# EAGLE design Emon (EAGLE 7.3.0)
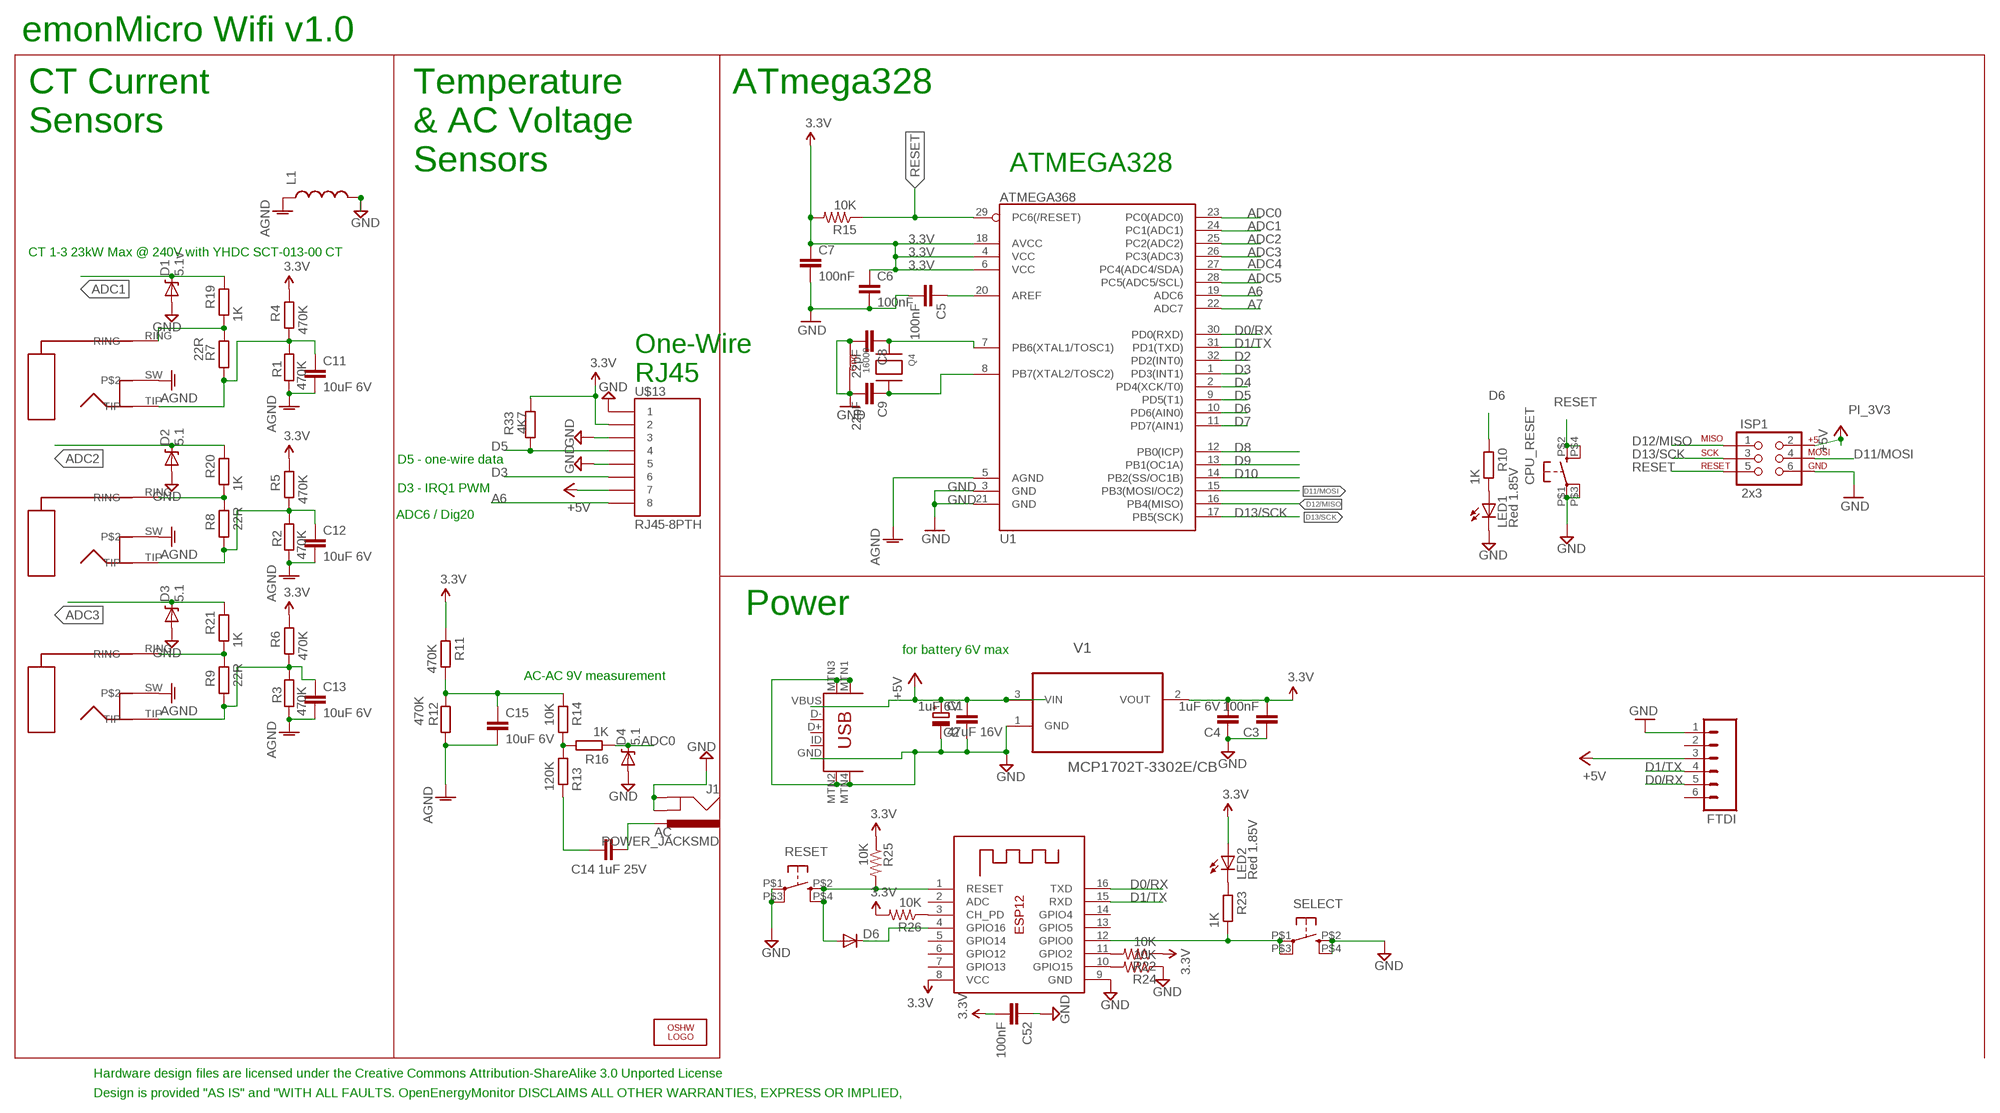
[diagram p0: schematic, sheet 1]

## Parts
C1  47uF 16V  CPOL-EUD  [PANASONIC_D]
C2  1uF 6V  C-EUC0603  [C0603]
C3  100nF  C-EUC0603  [C0603]
C4  1uF 6V  C-EUC0603  [C0603]
C5  100nF  C-EUC0603  [C0603]
C6  100nF  C-EUC0603  [C0603]
C7  100nF  C-EUC0603  [C0603]
C8  22pF  C-EUC0603  [C0603]
C9  22pF  C-EUC0603  [C0603]
C11  10uF 6V  C-EUC0603  [C0603]
C12  10uF 6V  C-EUC0603  [C0603]
C13  10uF 6V  C-EUC0603  [C0603]
C14  1uF 25V  C-EUC0603  [C0603]
C15  10uF 6V  C-EUC0603  [C0603]
C52  100nF  C-EUC0603  [C0603]
CPU_RESET  KMR211GLFS  BUTTON-KMR241GLFS  [PUSHBUTTON-KMR241GLFS]
D1  5.1v  DIODE-ZENER-BZT52  [SOD-323]
D2  5.1  DIODE-ZENER-BZT52  [SOD-323]
D3  5.1  DIODE-ZENER-BZT52  [SOD-323]
D4  5.1  DIODE-ZENER-BZT52  [SOD-323]
D6  DIODESOD  [SOD-323]
FTDI  M06LOCK  [1X06_LOCK]
ISP1  2x3  AVR_SPI_PRG_6PTH  [2X3]
J1  POWER_JACKSMD  [POWER_JACK_SMD]
L1  INDUCTOR0603  [0603]
LED1  Red 1.85V  LEDCHIP-LED0805  [CHIP-LED0805]
LED2  Red 1.85V  LEDCHIP-LED0805  [CHIP-LED0805]
LOGO1  OSHW_LOGO_6MILX0200-NT  [OSHW_6X200_NOTEXT]
Q4  16000  XTAL-4-3225  [NX3225]
R1  470K  R-EU_R0603  [R0603]
R2  470K  R-EU_R0603  [R0603]
R3  470K  R-EU_R0603  [R0603]
R4  470K  R-EU_R0603  [R0603]
R5  470K  R-EU_R0603  [R0603]
R6  470K  R-EU_R0603  [R0603]
R7  22R  R-EU_R1206  [R1206]
R8  22R  R-EU_R1206  [R1206]
R9  22R  R-EU_R1206  [R1206]
R10  1K  R-EU_R0603  [R0603]
R11  470K  R-EU_R0603  [R0603]
R12  470K  R-EU_R0603  [R0603]
R13  120K  R-EU_R0603  [R0603]
R14  10K  R-EU_R0603  [R0603]
R15  10K  R-US_R0603  [R0603]
R16  1K  R-EU_R0603  [R0603]
R19  1K  R-EU_R0603  [R0603]
R20  1K  R-EU_R0603  [R0603]
R21  1K  R-EU_R0603  [R0603]
R22  10K  R-US_R0603  [R0603]
R23  1K  R-EU_R0603  [R0603]
R24  10K  R-US_R0603  [R0603]
R25  10K  R-US_R0603  [R0603]
R26  10K  R-US_R0603  [R0603]
R33  4K7  R-EU_R0603  [R0603]
RESET  KMR211GLFS  BUTTON-KMR241GLFS  [PUSHBUTTON-KMR241GLFS]
SELECT  KMR211GLFS  BUTTON-KMR241GLFS  [PUSHBUTTON-KMR241GLFS]
U1  ATMEGA368  ATMEGA168  [TQFP32-08]
U$1  MJ-3523-SMT  [AUDIO_SMT]
U$2  MJ-3523-SMT  [AUDIO_SMT]
U$3  MJ-3523-SMT  [AUDIO_SMT]
U$13  RJ45-8PTH  [RJ45-8]
USB_POWER  USB-MINIB-5PIN  [USB-MINIB-CISECO]
V1  MCP1702T-3302E/CB  MCP1700T-3302E/TT  [SOT95P237X112-3N]
X1  ESP-12  [ESP-12]

## Nets
3.3V: C3.2 C4.2 C6.1 C7.1 C52.2 LED2.A R4.2 R5.2 R6.2 R11.2 R15.2 R22.1 R25.1 R26.2 R33.1 U1.4(VCC) U1.6(VCC) U1.18(AVCC) U$13.2 V1.2(VOUT) X1.8(VCC)
+5V [power]: C1.+ C2.2 FTDI.3 ISP1.2 U$13.7 USB_POWER.VBUS V1.3(VIN)
A6: U1.19(ADC6) U$13.8
A7: U1.22(ADC7)
AC: C14.2 J1.VIN0(PWR)
ADC0: D4.1(C) R16.1 U1.23(PC0(ADC0))
ADC1: D1.1(C) R19.2 U1.24(PC1(ADC1))
ADC2: D2.1(C) R20.2 U1.25(PC2(ADC2))
ADC3: D3.1(C) R21.2 U1.26(PC3(ADC3))
ADC4: U1.27(PC4(ADC4/SDA))
ADC5: U1.28(PC5(ADC5/SCL))
AGND [gnd]: C11.2 C12.2 C13.2 C15.2 L1.1 R1.2 R2.2 R3.2 R12.1 U1.5(AGND) U$1.SW U$2.SW U$3.SW
D0/RX: FTDI.5 U1.30(PD0(RXD)) X1.16(TXD)
D1/TX: FTDI.4 U1.31(PD1(TXD)) X1.15(RXD)
D2: U1.32(PD2(INT0))
D3: U1.1(PD3(INT1)) U$13.6
D4: U1.2(PD4(XCK/T0))
D5: R33.2 U1.9(PD5(T1)) U$13.4
D6: R10.2 U1.10(PD6(AIN0))
D7: U1.11(PD7(AIN1))
D8: U1.12(PB0(ICP))
D9: U1.13(PB1(OC1A))
D10: U1.14(PB2(SS/OC1B))
D11/MOSI: ISP1.4 U1.15(PB3(MOSI/OC2))
D12/MISO: ISP1.1 U1.16(PB4(MISO))
D13/SCK: ISP1.3 U1.17(PB5(SCK))
GND [gnd]: C1.- C2.1 C3.1 C4.1 C5.2 C6.2 C7.2 C8.2 C9.2 C52.1 CPU_RESET.P$1 CPU_RESET.P$3 D1.2(A) D2.2(A) D3.2(A) D4.2(A) FTDI.1 ISP1.6 J1.GND(GNDBREAK) J1.P$4(GND) L1.2 LED1.C Q4.1(G1) Q4.3(G2) R24.1 RESET.P$1 RESET.P$3 SELECT.P$2 SELECT.P$4 U1.3(GND) U1.21(GND) U$13.1 U$13.3 U$13.5 USB_POWER.GND USB_POWER.MTN1(MTN2) USB_POWER.MTN2(MTN3) USB_POWER.MTN3(MTN1) USB_POWER.MTN4 V1.1(GND) X1.9(GND)
GND1: R23.1 SELECT.P$1 SELECT.P$3 X1.12(GPIO0)
N$1: C8.1 Q4.2(X1) U1.7(PB6(XTAL1/TOSC1))
N$2: R7.2 R19.1 U$2.RING
N$3: C13.1 R3.1 R6.1 R9.1 U$3.TIP
N$4: R13.2 R14.1 R16.2
N$5: R24.2 X1.10(GPIO15)
N$6: R22.2 X1.11(GPIO2)
N$7: C14.1 R13.1
N$8: R26.1 X1.3(CH_PD)
N$10: R8.2 R20.1 U$1.RING
N$11: LED2.C R23.2
N$12: D6.1(C) X1.4(GPIO16)
N$13: R9.2 R21.1 U$3.RING
N$14: C9.1 Q4.4(X2) U1.8(PB7(XTAL2/TOSC2))
N$15: D6.2(A) R25.2 RESET.P$2 RESET.P$4 X1.1(RESET)
N$20: C5.1 U1.20(AREF)
N$33: C12.1 R2.1 R5.1 R8.1 U$1.TIP
N$34: C15.1 R11.1 R12.2 R14.2
N$38: C11.1 R1.1 R4.1 R7.1 U$2.TIP
N$41: LED1.A R10.1
RESET: CPU_RESET.P$2 CPU_RESET.P$4 ISP1.5 R15.1 U1.29(PC6(/RESET))
Unconnected: FTDI.2 FTDI.6 USB_POWER.D+ USB_POWER.D- USB_POWER.ID X1.2(ADC) X1.5(GPIO14) X1.6(GPIO12) X1.7(GPIO13) X1.13(GPIO5) X1.14(GPIO4)

## Notes on the sheet
- emonMicro Wifi v1.0
- ATmega328
- CT Current 
  Sensors
- Temperature 
  & AC Voltage
  Sensors
- ATMEGA328
- CT 1-3 23kW Max @ 240V with YHDC SCT-013-00 CT
- One-Wire
  RJ45
- D5 - one-wire data
- D3 - IRQ1 PWM
- ADC6 / Dig20
- Power
- for battery 6V max
- AC-AC 9V measurement
- Hardware design files are licensed under the Creative Commons Attribution-ShareAlike 3.0 Unported License
- Design is provided "AS IS" and "WITH ALL FAULTS. OpenEnergyMonitor DISCLAIMS ALL OTHER WARRANTIES, EXPRESS OR IMPLIED,

## Library data of the parts
C1 = resistor:CPOL-EU: POLARIZED CAPACITOR, European symbol
C2-C6 C8 C9 C11-C15 C52 = resistor:C-EU: CAPACITOR, European symbol
C7 = rcl:C-EU: CAPACITOR, European symbol
CPU_RESET RESET SELECT = okie:BUTTON-KMR241GLFS
D1-D4 = SparkFun:DIODE-ZENER: Zener Diode Production Part - 8199 3.4V Zener Voltage
D6 = SparkFun:DIODE: Diode These are standard reverse protection diodes and small signal diodes. SMA package can handle up to about 1A. SOD-323 can handle about 200mA. What the SOD-323 package when ordering, there are some mfgs out there that are 5-pin packages.
FTDI = SparkFun:M06: Header 6 Standard 6-pin 0.1" header. Use with straight break away headers (SKU : PRT-00116), right angle break away headers (PRT-00553), swiss pins (PRT-00743), machine pins (PRT-00117), and female headers (PRT-00115). Molex polarized connector foot print use with SKU : PRT-08094 with associated crimp pins and housings. NOTES ON THE VARIANTS LOCK and LOCK_LONGPADS... This footprint was designed to help hold the alignment of a through-hole component (i.e. 6-pin header) while soldering it into place. You may notice that each hole has been shifted either up or down by 0.005 of an inch from it's more standard position (which is a perfectly straight line). This slight alteration caused the pins (the squares in the middle) to touch the edges of the holes. Because they are alternating, it causes a "brace" to hold the component in place. 0.005 has proven to be the perfect amount of "off-center" position when using our standard breakaway headers. Although looks a little odd when you look at the bare footprint, once you have a header in there, the alteration is very hard to notice. Also, if you push a header all the way into place, it is covered up entirely on the bottom side. This idea of altering the position of holes to aid alignment will be further integrated into the Sparkfun Library for other footprints. It can help hold any component with 3 or more connection pins.
ISP1 = SparkFun:AVR_SPI_PRG_6: AVR ISP 6 Pin This is the reduced ISP connector for AVR programming. Common on Arduino. This footprint will take up less PCB space and can be used with a 10-pin to 6-pin adapter such as SKU: BOB-08508
J1 = SparkFun:POWER_JACK: Power Jack This is the standard 5.5mm barrel jack for power. The PTH is the most common, proven, reliable, footprint. All others are experimental. The Slot footprint only works if the mill layer is transmitted to the PCB fab house so be warned. Spark Fun Electronics SKU : PRT-00119. Mating wall wart : TOL-00298 (and others)
L1 = SparkFun:INDUCTOR: Inductors Basic Inductor/Choke - 0603 and 1206. Footprints are not proven and vary greatly between part numbers.
LED1 LED2 = adafruit:LED: LED OSRAM: - CHIPLED LG R971, LG N971, LY N971, LG Q971, LY Q971, LO R971, LY R971 LH N974, LH R974 LS Q976, LO Q976, LY Q976 LO Q996 - Hyper CHIPLED LW Q18S LB Q993, LB Q99A, LB R99A - SideLED LS A670, LO A670, LY A670, LG A670, LP A670 LB A673, LV A673, LT A673, LW A673 LH A674 LY A675 LS A676, LA A676, LO A676, LY A676, LW A676 LS A679, LY A679, LG A679 - Hyper Micro SIDELED� LS Y876, LA Y876, LO Y876, LY Y876 LT Y87S - SmartLED LW L88C, LW L88S LB L89C, LB L89S, LG L890 LS L89K, LO L89K, LY L89K LS L896, LA L896, LO L896, LY L896 - TOPLED LS T670, LO T670, LY T670, LG T670, LP T670 LSG T670, LSP T670, LSY T670, LOP T670, LYG T670 LG T671, LOG T671, LSG T671 LB T673, LV T673, LT T673, LW T673 LH T674 LS T676, LA T676, LO T676, LY T676, LB T676, LH T676, LSB T676, LW T676 LB T67C, LV T67C, LT T67C, LS T67K, LO T67K, LY T67K, LW E67C LS E67B, LA E67B, LO E67B, LY E67B, LB E67C, LV E67C, LT E67C LW T67C LS T679, LY T679, LG T679 LS T770, LO T770, LY T770, LG T770, LP T770 LB T773, LV T773, LT T773, LW T773 LH T774 LS E675, LA E675, LY E675, LS T675 LS T776, LA T776, LO T776, LY T776, LB T776 LHGB T686 LT T68C, LB T68C - Hyper Mini TOPLED� LB M676 - Mini TOPLED Santana� LG M470 LS M47K, LO M47K, LY M47K Source: http://www.osram.convergy.de/
LOGO1 = ohw-logo:OSHW_LOGO_6MIL
Q4 = adafruit:XTAL-4: Classic 4-pin 3.2 x 2.5mm crystal
R1-R14 R16 R19-R21 R23 R33 = rcl:R-EU_: RESISTOR, European symbol
R15 R22 R24-R26 = adafruit:R-US_: RESISTOR, American symbol
U1 = SparkFun:ATMEGA168
U$1-U$3 = Qxd:MJ-3523-SMT
U$13 = SparkFun-Connectors:RJ45-8: RJ45 Jack Simple RJ45, 8-pin connection - connector for common Cat5, Cat5e, and Cat6 Ethernet cables. Footprint not yet proven in production. Connector sku is PRT-00643; Breakout PCB sku is BOB-00716.
USB_POWER = Ciseco USB miniB:USB-MINIB: Mini-USB "B" connector with 5th pin broken out. Created new symbol breaking out 5th "ID" pin in mini/micro USB connector spec. See: http://en.wikipedia.org/wiki/Mini_usb#Cables. Uses same footprint as 4-pin symbol. Also added pins to connect to mounting / shield pads if required (probably not generally needed as signals aren't shielded once they leave the connector). Modified by Ciseco for Rapid Part 24-0357
V1 = Farnell_MCP1700:MCP1700T-3302E/TT: Low Quiescent Current LDO; MPN: MCP1700T-3302E/TT; OC_FARNELL: 1296592; OC_NEWARK: 88H9817; PACKAGE: SOT23-3; SUPPLIER: Microchip
X1 = adafruit:ESP-12

## Net classes
0 default: width 0.203 mm, drill 0.6 mm, clearance 0.203 mm
1 power: width 0.305 mm, drill 0.6 mm, clearance 0.254 mm
2 gnd: width 0.254 mm, drill 0.6 mm, clearance 0.254 mm

## Board
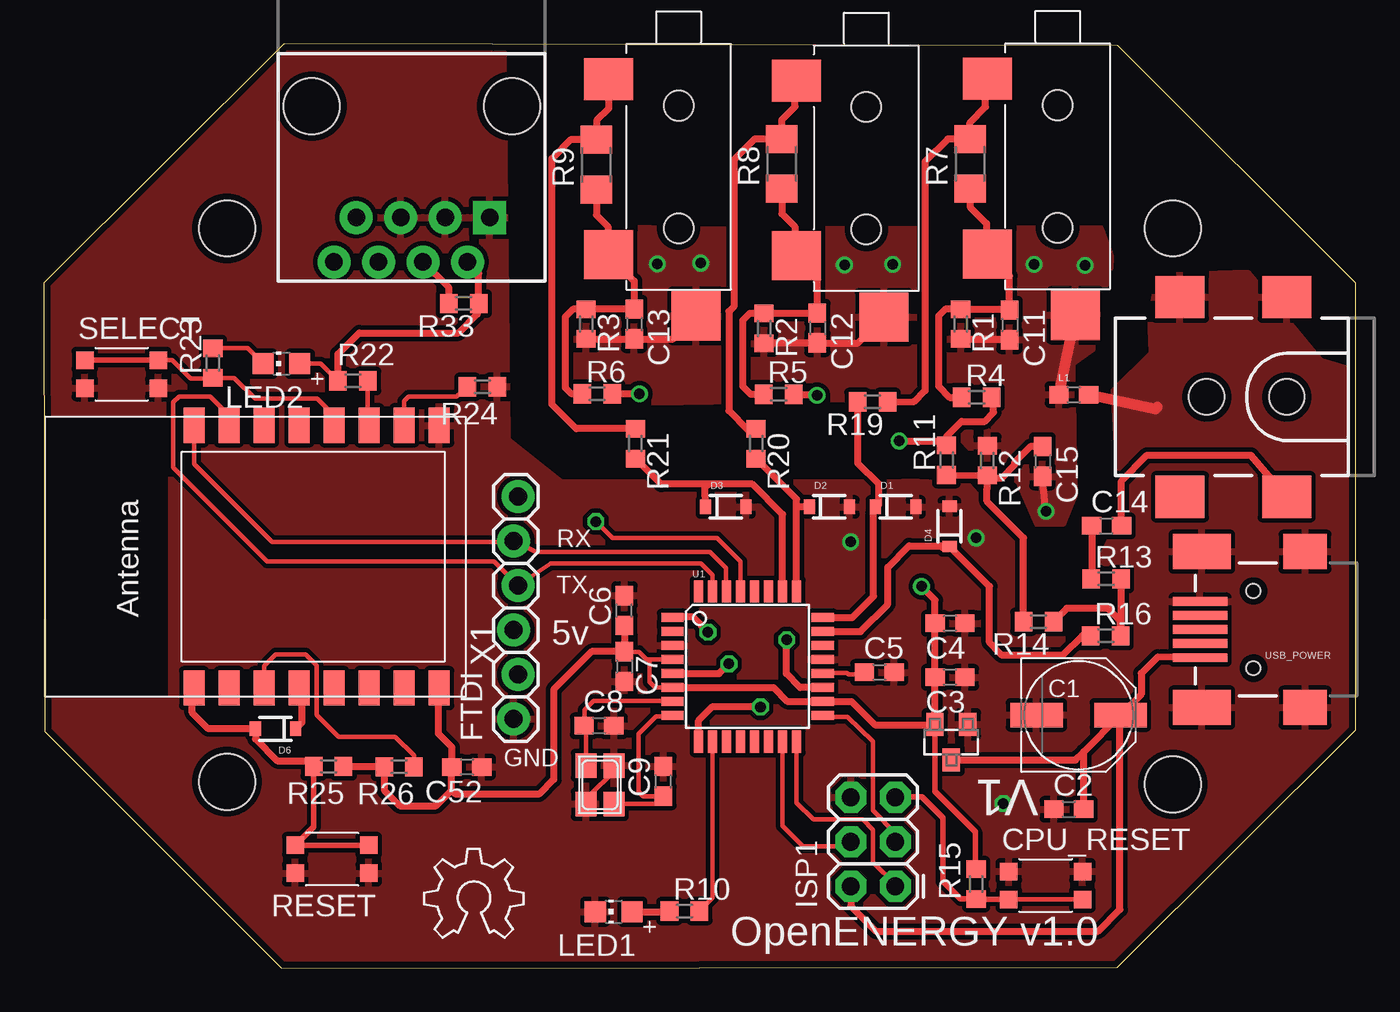
[diagram p1: board, top side]
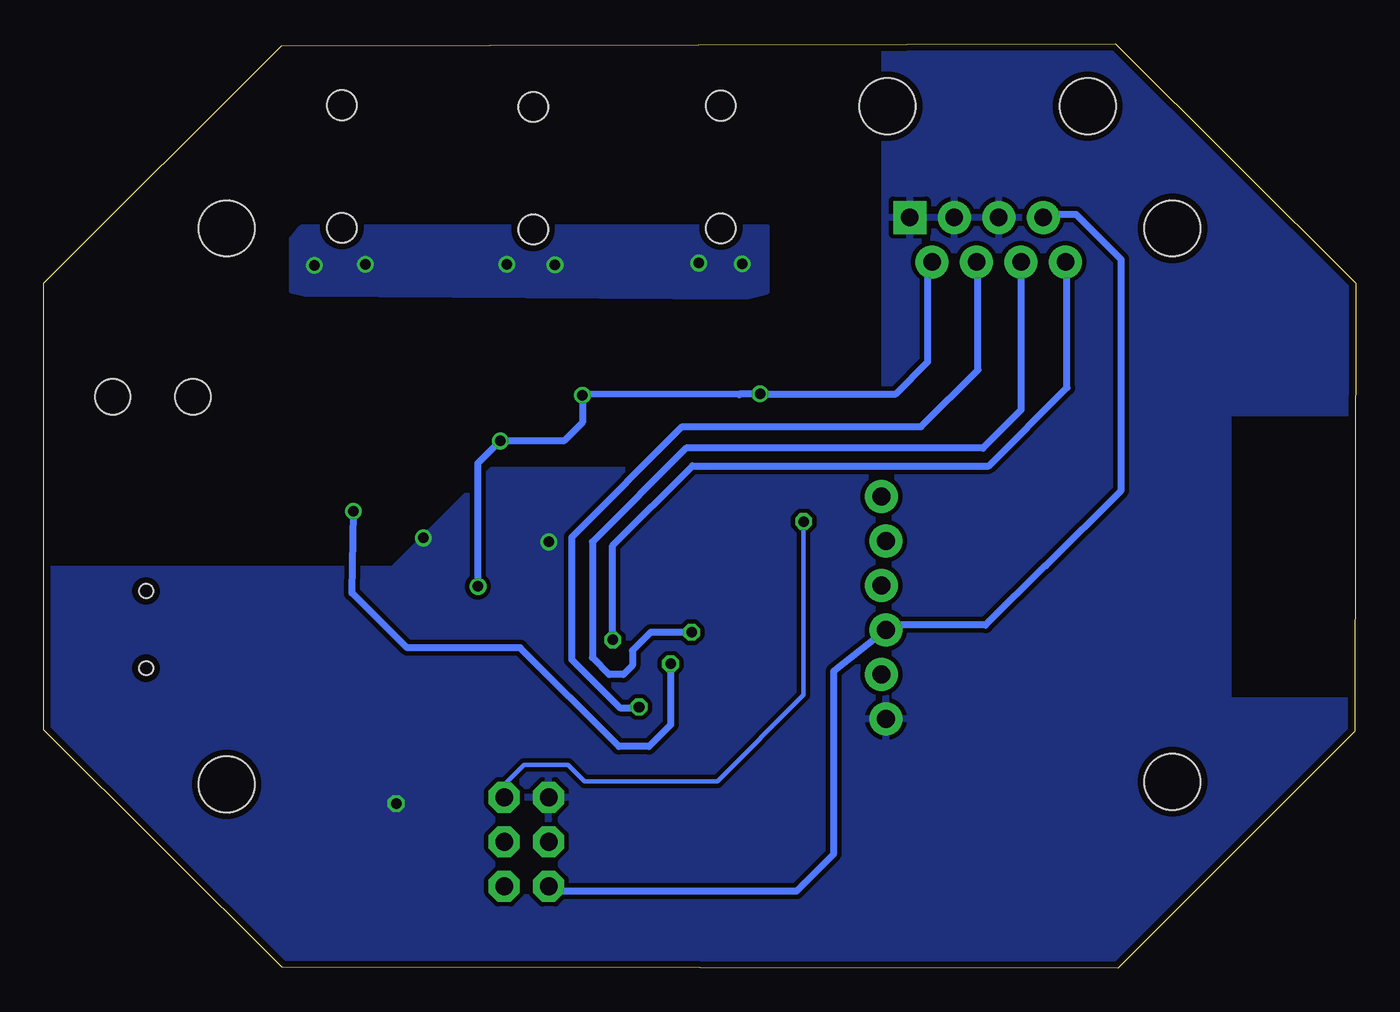
[diagram p2: board, bottom side, seen from below]

Size 74.9 x 52.78 mm. Coordinates in mm from the lower left corner, seen from the top.
Outline: 0.05,13.51 13.59,0 61.29,0.05 74.91,13.59 74.91,39.11 61.33,52.68 13.72,52.78 0,39.11 0.05,13.51
Copper layers (1*16): Top 0.0356mm / dielectric 1.5011mm / Bottom 0.0356mm
Design rules "LaenPCBOrder": minimum track width 6mil, minimum drill 13mil, track to track 6mil, track to pad 6mil, pad to pad 6mil, via to via 6mil, smd to smd 6mil, copper to edge 15mil, drill to drill 6mil, minimum pad ring 7mil, minimum via ring 7mil, stop-mask expansion 4mil, vias tented up to drill 0mil, thermal gap 10mil
Holes 3.2 mm at 10.46,10.64 64.47,42.24 64.47,10.49 10.46,42.24

### Footprints (pad centres in the part's own frame; a part is rotated, then mirrored left to right if it is on the bottom)
PANASONIC_D = smd 3 x 1.4: + 2.4,0; - -2.4,0
C0603 = smd 1.1 x 1: 1 -0.85,0; 2 0.85,0
PUSHBUTTON-KMR241GLFS = smd 1 x 1: P$1 2.1,0.8; P$2 2.1,-0.8; P$3 -2.1,0.8; P$4 -2.1,-0.8
SOD-323 = smd 0.63 x 0.83: 1 -1.15,0; 2 1.15,0
1X06_LOCK = drill 1.016 pad 1.88: 1 0,0; 2 2.54,-0.254; 3 5.08,0; 4 7.62,-0.254; 5 10.16,0; 6 12.7,-0.254
2X3 = drill 1.016 pad 1.778 octagon: 1 0,0; 2 0,2.54; 3 2.54,0; 4 2.54,2.54; 5 5.08,0; 6 5.08,2.54
POWER_JACK_SMD = smd 2.8 x 2.4: GND 0,-5.7; P$4 6.1,-5.7; VIN0 0,5.7; VIN1 6.1,5.7 | hole 2.032: 0,0; 4.572,0
0603 = smd 1.1 x 1: 1 -0.85,0; 2 0.85,0
CHIP-LED0805 = smd 1.2 x 1.2: A 0,-1.05; C 0,1.05
NX3225 = smd 1.4 x 1.2: 1 -1.1,0.8; 2 1.1,0.8; 3 1.1,-0.8; 4 -1.1,-0.8
R0603 = smd 1 x 1.1: 1 -0.85,0; 2 0.85,0
R1206 = smd 1.6 x 1.803: 1 -1.422,0; 2 1.422,0
TQFP32-08 = smd 1.27 x 0.508: 1 -4.293,2.8; 2 -4.293,2; 3 -4.293,1.2; 4 -4.293,0.4; 5 -4.293,-0.4; 6 -4.293,-1.2; 7 -4.293,-2; 8 -4.293,-2.8; 17 4.293,-2.8; 18 4.293,-2; 19 4.293,-1.2; 20 4.293,-0.4; 21 4.293,0.4; 22 4.293,1.2; 23 4.293,2; 24 4.293,2.8 | smd 0.508 x 1.27: 9 -2.8,-4.293; 10 -2,-4.293; 11 -1.2,-4.293; 12 -0.4,-4.293; 13 0.4,-4.293; 14 1.2,-4.293; 15 2,-4.293; 16 2.8,-4.293; 25 2.8,4.293; 26 2,4.293; 27 1.2,4.293; 28 0.4,4.293; 29 -0.4,4.293; 30 -1.2,4.293; 31 -2,4.293; 32 -2.8,4.293
AUDIO_SMT = smd 2.4 x 2.8: RING 5,4 | smd 2.8 x 2.8: SW -8.5,-1; TIP -5,4 | hole 1.7: 3.5,0; -3.5,0
RJ45-8 = drill 1 pad 1.88 square: 1 -4.445,6.35 | drill 1 pad 1.88: 2 -3.175,8.89; 3 -1.905,6.35; 4 -0.635,8.89; 5 0.635,6.35; 6 1.905,8.89; 7 3.175,6.35; 8 4.445,8.89 | hole 3.2: -5.715,0; 5.715,0
USB-MINIB-CISECO = smd 3.1 x 0.5: D+ 8.25,0; D- 8.25,0.8; GND 8.25,-1.6; ID 8.25,-0.8; VBUS 8.25,1.6 | smd 2.5 x 2: MTN1 2.25,4.45; MTN3 2.25,-4.45 | smd 3.3 x 2: MTN2 8.15,4.45; MTN4 8.15,-4.45 | hole 0.8: 5.2,2.2; 5.2,-2.2
SOT95P237X112-3N = smd 0.991 x 1.321: 1 -0.94,-1.016; 2 0.94,-1.016; 3 0,1.016
ESP-12 = smd 2 x 1.2: 1 -7.5,4.5; 2 -7.5,2.5; 3 -7.5,0.5; 4 -7.5,-1.5; 5 -7.5,-3.5; 6 -7.5,-5.5; 7 -7.5,-7.5; 8 -7.5,-9.5; 9 7.5,-9.5; 10 7.5,-7.5; 11 7.5,-5.5; 12 7.5,-3.5; 13 7.5,-1.5; 14 7.5,0.5; 15 7.5,2.5; 16 7.5,4.5

### Placement (x,y rotation side)
C1  59.08,14.45 0 top
C2  58.52,9.07 0 top
C3  51.74,16.61 180 top
C4  51.74,19.68 180 top
C5  47.7,16.89 0 top
C6  33.15,20.42 90 top
C7  33.15,17.22 270 top
C8  31.7,13.84 0 top
C9  35.38,10.67 90 top
C11  55.14,36.73 270 top
C12  44.17,36.55 270 top
C13  33.71,36.78 270 top
C14  60.68,25.25 0 top
C15  57.02,28.93 270 top
C52  24.16,11.48 180 top
CPU_RESET  57.2,4.72 0 top
D1  48.64,26.34 0 top
D2  44.86,26.34 0 top
D3  38.94,26.34 0 top
D4  51.71,25.22 90 top
D6  13.23,13.67 180 top
FTDI  26.82,14.22 90 top
ISP1  48.62,4.67 90 top
J1  70.97,32.61 180 top
L1  58.8,32.74 0 top
LED1  32.54,3.23 90 top
LED2  13.56,34.52 90 top
LOGO1  21.72,1.73 0 top
Q4  31.75,10.46 90 top
R1  52.35,36.78 270 top
R2  41.12,36.53 270 top
R3  30.96,36.78 270 top
R4  53.26,32.59 0 top
R5  41.96,32.77 0 top
R6  31.6,32.79 0 top
R7  52.88,45.92 90 top
R8  42.14,45.92 90 top
R9  31.55,45.87 90 top
R10  36.58,3.25 0 top
R11  51.54,29.01 90 top
R12  53.87,28.98 270 top
R13  60.66,22.23 0 top
R14  56.79,19.79 180 top
R15  53.24,4.8 90 top
R16  60.63,18.97 0 top
R19  47.32,32.33 180 top
R20  40.67,29.95 270 top
R21  33.78,29.95 270 top
R22  17.65,33.53 0 top
R23  9.65,34.54 90 top
R24  25.04,33.2 180 top
R25  16.27,11.52 180 top
R26  20.28,11.49 180 top
R33  23.98,37.95 180 top
RESET  16.46,6.22 180 top
SELECT  4.45,33.91 0 top
U1  40.18,17.22 0 top
U$1  46.96,45.67 90 top
U$2  57.89,45.77 90 top
U$3  36.25,45.75 90 top
U$13  21.01,49.22 180 top
USB_POWER  74.26,19.33 180 top
V1  51.82,12.9 180 top
X1  13.08,23.5 90 top

### Tracks (layer width: path | path; a pad name or v marks a point on that pad's centre or on a via)
3.3V  (via drill 0.6)
  Top 0.254: U1.4 34.59,17.62 | 34.59,17.62 34.42,17.62 33.98,18.06 C7.1 | U1.6 34.91,16.02 34.59,16.33 34.59,17.62 | LED2.A 15.81,34.52 R22.1
  Top 0.305: 33.33,17.65 C7.1 | V1.2 50.88,10.08 53.19,7.77 53.19,5.7 R15.2 | X1.8
  Top 0.406: 33.11,19.53 C6.1 C7.1 31.28,18.07 29.11,15.9 29.11,10.77 28.27,9.93 23.52,9.93 23.29,10.16 | U$13.2 24.83,39.69 R33.1 24.74,37.86 24.74,37.34 23.67,36.27 18.01,36.27 16.8,35.07 R22.1 | U1.6 41.66,16.02 42.44,15.24 44.46,15.24 U1.18 46.12,15.22 47.45,13.89 50.85,13.89 V1.2 50.88,16.6 C3.2 C4.2 50.89,21.02 v50.11,21.79 | R4.2 54.23,32.47 54.23,31.73 53.72,31.22 52.4,31.22 51.56,30.38 R11.2 51.29,30.1 v48.84,30.1 | v44.15,32.72 42.86,32.72 R5.2 | v34.01,32.79 R6.2 | R25.1 19.41,11.52 R26.2 19.43,10.16 20.32,9.27 22.4,9.27 23.29,10.16 | 23.29,10.16 23.29,11.47 C52.2 23.3,12.61 22.53,13.39 22.53,15.94 X1.8
  Bottom 0.406: U$13.2 24.43,40.08 24.43,34.62 26.26,32.79 v34.01,32.79 35.15,32.79 35.2,32.74 44.09,32.77 v44.15,32.72 44.15,31.17 45.21,30.1 v48.84,30.1 50.11,28.83 v50.11,21.79
+5V
  Top 0.406: ISP1.2 46.08,3.53 47.5,2.11 60.2,2.11 61.44,3.35 61.44,14.42 C1.+ | 51.78,11.85 V1.3 58.91,11.89 59.37,12.35 | USB_POWER.VBUS 63.6,17.76 62.66,16.84 62.66,15.64 C1.+ | C2.2 59.37,12.35 | 59.37,12.35 C1.+
  Bottom 0.406: ISP1.2 45.8,4.39 31.93,4.39 29.79,6.53 29.79,16.97 FTDI.3 27.18,19.58 21.13,19.58 17.73,22.99 17.68,22.99 13.39,27.28 13.39,40.46 15.95,43.03 17.68,43.03 U$13.7
A6  (via drill 0.6)
  Top 0.406: U1.19 43.19,16.02 42.39,16.82 42.39,18.72 v42.42,18.75
  Bottom 0.406: v42.42,18.75 42.42,24.13 37.87,28.68 20.95,28.68 16.48,33.15 16.48,40.24 U$13.8
AC
  Top 0.406: C14.2 61.53,27.82 62.99,29.29 68.92,29.29 J1.VIN0
ADC0
  Top 0.406: R16.1 59.28,18.97 58.17,17.86 54.71,17.86 54.3,18.26 54.3,18.29 54,18.59 54,21.79 51.75,24.02 | U1.23 46.63,19.22 48.18,20.78 48.18,22.89 49.4,24.11 51.22,24.11 51.31,24.02 51.75,24.02 | D4.1 51.71,24.05 51.75,24.02
ADC1
  Top 0.254: 47.65,26.4 47.55,26.4 D1.1 47.54,26.24 47.37,26.07
  Top 0.406: U1.24 46.16,20.02 47.37,21.23 47.37,26.07 | R19.2 46.47,28.84 47.65,27.66 47.65,26.4
ADC2
  Top 0.406: 40.77,29.2 R20.2 42.98,26.78 42.98,26.42 | U1.25 42.98,26.42 | D2.1 43.06,26.34 42.98,26.42
ADC3
  Top 0.406: U1.26 42.18,25.91 40.46,27.64 38,27.64 | 33.83,29.04 R21.2 35.24,27.64 38,27.64 | D3.1 37.76,27.49 38,27.64
AGND  (via drill 0.6)
  Top 0.406: U$1.SW 46.49,35.7 C12.2 41.15,35.7 R2.2 | U$3.SW 35.93,35.93 C13.2 R3.2 | C11.2 52.4,35.88 R1.2 | U1.5 38.56,16.82 v39.12,17.37 | v57.23,26.09 C15.2
  Top 0.61: L1.1 59.13,38.43 U$2.SW
  Bottom 0.406: v39.12,17.37 39.12,13.89 40.36,12.65 42.06,12.65 47.7,18.29 54.15,18.29 57.3,21.41 v57.23,26.09
  other vias: 37.52,40.26 48.46,40.18 56.54,40.18 35.03,40.21 45.72,40.16 59.46,40.13
  pour Top: 36.2,42.16 60.3,42.27 60.93,40.54 60.86,40.23 60.88,39.98 60.73,40.11 60.68,39.42 60.66,39.09 60.4,38.79 60.22,38.07 59.89,35.38 58.7,34.52 58.8,26.92 58.19,25.4 56.74,25.35 55.68,27.79 53.16,29.41 50.27,32.54 29.62,32.21 29.64,40.59 31.62,42.42
  pour Bottom: 33.63,38.66 33.63,42.29 34.65,42.24 60.2,42.24 60.73,41.61 60.73,38.71 59.99,38.53 34.77,38.38
D0/RX
  Top 0.254: U1.30 38.94,21.56 38.94,22.84 38.02,23.75 28.09,23.75 FTDI.5 26.77,24.33 13.03,24.33 8.58,28.78 X1.16
D1/TX
  Top 0.254: 10.54,30.95 X1.15 10.58,31.56 9.5,32.64 7.72,32.64 7.39,32.31 7.39,28.57 12.75,23.22 25.7,23.22 FTDI.4 28.93,23.11 37.52,23.11 38.18,22.45 U1.31
D3  (via drill 0.6)
  Top 0.406: U1.1 35.91,20.04 37.06,20.04 v37.92,19.18
  Bottom 0.406: U$13.6 19.11,31.87 21.29,29.69 38.23,29.69 43.59,24.33 43.59,17.73 42.62,16.76 41.81,16.76 41.3,17.27 41.3,18.14 40.26,19.18 v37.92,19.18
D5  (via drill 0.6)
  Top 0.406: R33.2 23.13,38.84 U$13.4 | U1.9 37.38,14.14 38.15,14.91 v40.92,14.91
  Bottom 0.406: U$13.4 21.57,40.24 21.57,34.16 24.82,30.91 38.46,30.91 44.76,24.61 44.76,17.6 42.01,14.86 40.97,14.86 v40.92,14.91
D6
  Top 0.254: U1.10 38.18,4.01 R10.2
D11/MOSI
  Top 0.254: U1.15 42.18,8.13 43.36,6.96 45.82,6.96 ISP1.4
D12/MISO
  Top 0.254: ISP1.1 48.62,4.78 47.35,6.04 47.35,7.9 46.76,8.48 43.94,8.48 42.98,9.45 U1.16
D13/SCK
  Top 0.254: ISP1.3 48.62,7.7 47.35,9.02 47.35,12.95 45.9,14.35 44.55,14.35 U1.17
GND  (via drill 0.6)
  Top 0.254: Q4.3 32.55,11.24 31.17,9.86 31.17,9.58 Q4.1
  Top 0.61: L1.2 63.48,31.93 63.58,32.03
  other vias: 54.79,9.4 46.08,24.33 53.24,24.56
  pour Bottom: -11,62.53 -11.73,-8.28 106.68,-8.89 106.53,61.77 105.82,18.77 101.8,22.78 54.97,22.78 49.3,28.45 30.1,28.45 26.87,31.67 26.87,55.68 20.02,62.53
  pour Top: -9.27,54.36 -8.89,-6.35 105.41,-6.35 102.06,25.98 72.9,34.65 68.76,39.67 63.6,39.52 63.3,37.52 63.2,37.03 63.22,36.47 63.25,35.84 63.27,35.08 61.09,32.94 61.49,25.76 60.2,23.06 56.9,22.96 52.73,27.58 49.45,27.76 49,27.74 48.97,27.71 29.54,27.74 26.47,30.15 26.21,54.1
GND1
  Top 0.254: 6.31,34.71 7.33,34.71 8.38,33.66 9.61,33.66 | R23.1 10.88,33.69 12.06,32.51 15.62,32.51 16.26,31.88
  Top 0.305: SELECT.P$3 6.31,34.71 SELECT.P$1 | 9.61,33.66 R23.1 | 16.26,31.88 16.26,31.32 X1.12
N$1
  Top 0.254: Q4.2 30.95,13.51 C8.1 30.89,13.88 30.89,14.73 31.4,15.25 35.87,15.25 U1.7
N$2
  Top 0.406: U$2.RING 53.77,50.66 53.77,49.17 52.88,48.28 R7.2 51.61,47.34 50.32,46.05 50.32,32.97 49.71,32.36 R19.1
N$3
  Top 0.406: R9.1 31.55,43 32.21,42.34 32.21,40.78 U$3.TIP 32.25,40.7 33.71,39.24 C13.1 R3.1 30.21,37.63 29.77,37.19 29.77,33.15 30.1,32.82 30.72,32.82 R6.1
N$4
  Top 0.406: R13.2 61.51,19 R16.2 61.48,19.83 60.76,20.55 58.41,20.55 R14.1
N$5
  Top 0.254: X1.10 20.58,32.39 20.83,32.64 23.58,32.64 R24.2
N$6
  Top 0.254: R22.2 18.5,31.07 X1.11
N$7
  Top 0.406: C14.1 59.83,22.25 R13.1
N$8
  Top 0.254: R26.1 21.13,12.14 20.07,13.21 16.84,13.21 15.57,14.45 15.57,17.27 14.96,17.91 13.23,17.91 12.57,17.25 X1.3
N$10
  Top 0.406: U$1.RING 42.9,50.61 42.9,49.2 42.14,48.44 R8.2 40.59,47.34 39.4,46.15 39.4,37.77 39.12,37.49 39.12,31.83 40.25,30.7 R20.1
N$11
  Top 0.254: R23.2 11.64,35.39 LED2.C
N$12
  Top 0.254: 14.73,15.84 X1.4
  Top 0.406: 14.73,15.84 14.73,14.01 D6.1
N$13
  Top 0.406: U$3.RING 32.25,49.09 31.57,48.41 31.57,47.32 R9.2 30.07,47.29 29.01,46.23 29.01,32.18 30.39,30.8 R21.1
N$14
  Top 0.254: Q4.4 34.93,9.37 C9.1 34.23,9.82 33.96,10.08 33.96,13.39 34.95,14.38 35.77,14.38
  Top 0.406: 35.77,14.38 35.84,14.38 U1.8
N$15
  Top 0.254: 15.03,11.91 R25.2
  Top 0.305: RESET.P$4 RESET.P$2 15.42,8.08 R25.2 | 8.51,15.92 X1.1
  Top 0.406: X1.1 8.48,15.9 8.48,14.58 9.4,13.66 D6.2 12.08,13.09 13.34,11.84 15.1,11.84 R25.2
N$20
  Top 0.254: 47.14,16.8 C5.1 47.16,16.76 45.95,16.76 45.87,16.85 44.5,16.85 U1.20
N$33
  Top 0.406: R8.1 42.14,43.08 42.88,42.34 42.88,40.76 U$1.TIP 44.17,39.47 C12.1 44.15,37.38 R2.1 40.3,37.38 39.9,36.98 39.9,33.22 40.36,32.77 R5.1
N$34
  Top 0.406: R11.1 R12.2 | C15.1 56.32,29.78 55.42,28.88 55.42,28.73 54.66,27.96 54.12,27.96 R12.2 | R14.2 55.93,24.56 53.85,26.64 53.85,27.38 53.87,27.41 R12.2
N$38
  Top 0.406: R7.1 52.88,43.46 53.82,42.52 53.82,40.84 U$2.TIP 55.14,39.52 C11.1 55.09,37.63 R1.1 51.47,37.63 51.08,37.24 51.08,33.22 51.71,32.59 R4.1
N$41
  Top 0.406: LED1.A 35.7,3.23 R10.1
RESET  (via drill 0.6)
  Top 0.254: CPU_RESET.P$2 CPU_RESET.P$4 | U1.29 39.78,23.21 38.43,24.56 32.46,24.56 v31.52,25.5
  Top 0.305: CPU_RESET.P$4 53.27,3.92 R15.1 52.34,3.95 51.33,4.95 51.33,8.59 50.14,9.78 48.64,9.78 ISP1.5
  Bottom 0.254: v31.52,25.5 31.52,15.6 36.45,10.67 44.02,10.67 44.96,11.61 47.47,11.61 48.64,10.44 48.64,9.78 ISP1.5

### Text on the board
tNames: RX | TX | 5v | GND | OpenENERGY v1.0